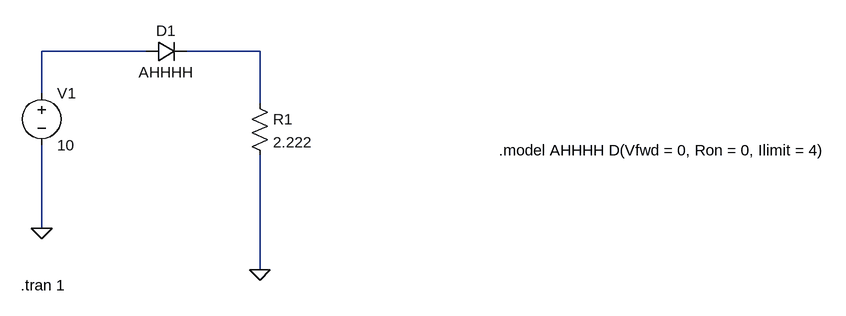
[diagram p0: schematic Current limiter current diode.asc]
Current limiter current diode.asc, the LTspice schematic file:
Version 4.1
SHEET 1 880 680
WIRE -352 -96 -512 -96
WIRE -176 -96 -288 -96
WIRE -512 -32 -512 -96
WIRE -176 -16 -176 -96
WIRE -512 176 -512 48
WIRE -176 240 -176 64
FLAG -512 176 0
FLAG -176 240 0
SYMBOL voltage -512 -48 R0
WINDOW 123 0 0 Left 0
WINDOW 39 0 0 Left 0
SYMATTR InstName V1
SYMATTR Value 10
SYMBOL diode -352 -80 R270
WINDOW 0 32 32 VTop 2
WINDOW 3 0 32 VBottom 2
SYMATTR InstName D1
SYMATTR Value AHHHH
SYMBOL res -192 -32 R0
SYMATTR InstName R1
SYMATTR Value 2.222
TEXT 192 56 Left 2 !.model AHHHH D(Vfwd = 0, Ron = 0, Ilimit = 4)
TEXT -544 264 Left 2 !.tran 1

The netlist it stands for:
* Current limiter current diode.asc
V1 N001 0 10
D1 N001 N002 AHHHH
R1 N002 0 2.222
.model D D
.lib standard.dio
.model AHHHH D(Vfwd = 0, Ron = 0, Ilimit = 4)
.tran 1
.backanno
.end